# Altium schematic sheet LumSensor.SchDoc
size A
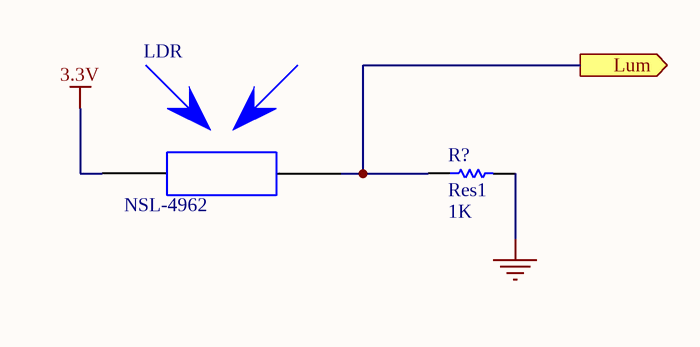
[diagram p0: LumSensor.SchDoc]

## Parts
LDR  NSL-4962
R?  Res1  value 1K  [AXIAL-0.3]

## Ports
Lum (out)

## Nets
3.3V: LDR.1
GND: R?.2
Lum: LDR.2 R?.1 ; port Lum

## Library data of the parts
R? = Res1: Resistor; Published: 8-Jun-2000; LatestRevisionDate: 17-Jul-2002; LatestRevisionNote: Re-released for DXP Platform.; PackageReference: AXIAL-0.3; Publisher: Altium Limited; PackageDescription: Axial Device, Thru-Hole; 2 Leads; 0.3 in Pin Spacing